# EAGLE design Template_V0.1 (EAGLE 7.0.0)
CNAME: EARS PocketQube Template; CREVISION: 0.1; DESIGNER: M. Isbell & L. Stant
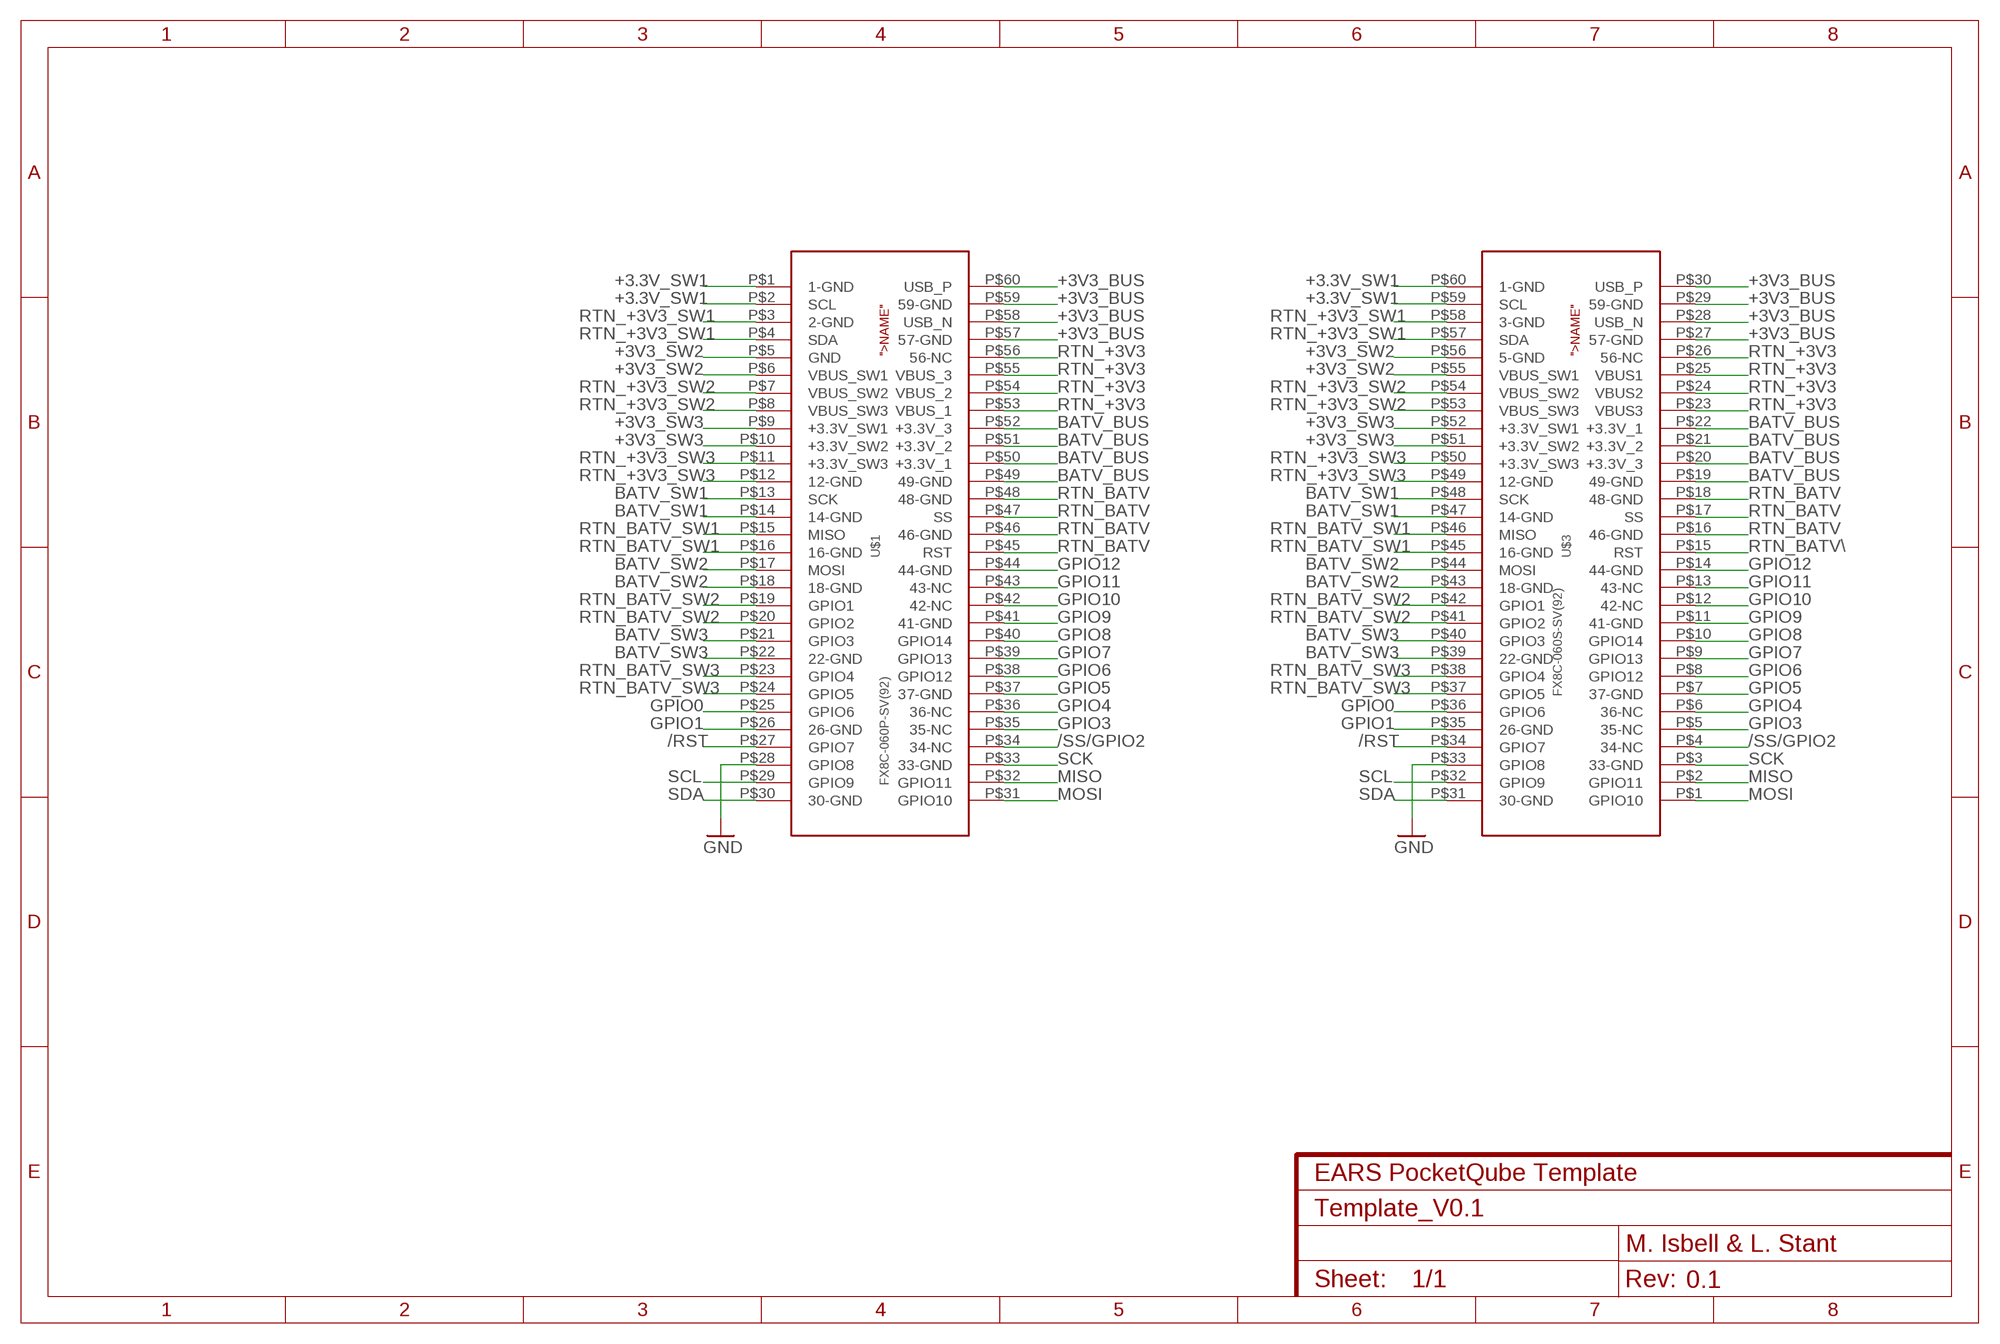
[diagram p0: schematic, sheet 1]

## Parts
U$1  FX8C-060P-SV(92)  [FX8C-060P-SV(92)]
U$3  FX8C-060S-SV(92)  [FX8C-060S-SV(92)]

## Nets
+3.3V_SW1: U$1.P$1(1-GND) U$1.P$2(SCL) U$3.P$59(SCL) U$3.P$60(1-GND)
+3V3_BUS: U$1.P$57(57-GND) U$1.P$58(USB_N) U$1.P$59(59-GND) U$1.P$60(USB_P)
+3V3_SW2: U$1.P$5(GND) U$1.P$6(VBUS_SW1) U$3.P$55(VBUS_SW1) U$3.P$56(5-GND)
+3V3_SW3: U$1.P$9(+3.3V_SW1) U$1.P$10(+3.3V_SW2) U$3.P$51(+3.3V_SW2) U$3.P$52(+3.3V_SW1)
/RST: U$1.P$27(GPIO7) U$3.P$34(GPIO7)
/SS/GPIO2: U$1.P$34(34-NC)
BATV_BUS: U$1.P$49(49-GND) U$1.P$50(+3.3V_1) U$1.P$51(+3.3V_2) U$1.P$52(+3.3V_3)
BATV_SW1: U$1.P$13(SCK) U$1.P$14(14-GND) U$3.P$47(14-GND) U$3.P$48(SCK)
BATV_SW2: U$1.P$17(MOSI) U$1.P$18(18-GND) U$3.P$43(18-GND) U$3.P$44(MOSI)
BATV_SW3: U$1.P$21(GPIO3) U$1.P$22(22-GND) U$3.P$39(22-GND) U$3.P$40(GPIO3)
GND: U$1.P$28(GPIO8) U$3.P$33(GPIO8)
GPIO0: U$1.P$25(GPIO6) U$3.P$36(GPIO6)
GPIO1: U$1.P$26(26-GND) U$3.P$35(26-GND)
GPIO3: U$1.P$35(35-NC)
GPIO4: U$1.P$36(36-NC)
GPIO5: U$1.P$37(37-GND)
GPIO6: U$1.P$38(GPIO12)
GPIO7: U$1.P$39(GPIO13)
GPIO8: U$1.P$40(GPIO14)
GPIO9: U$1.P$41(41-GND)
GPIO10: U$1.P$42(42-NC)
GPIO11: U$1.P$43(43-NC)
GPIO12: U$1.P$44(44-GND)
MISO: U$1.P$32(GPIO11)
MOSI: U$1.P$31(GPIO10)
RTN_+3V3: U$1.P$53(VBUS_1) U$1.P$54(VBUS_2) U$1.P$55(VBUS_3) U$1.P$56(56-NC)
RTN_+3V3_SW1: U$1.P$3(2-GND) U$1.P$4(SDA) U$3.P$57(SDA) U$3.P$58(3-GND)
RTN_+3V3_SW2: U$1.P$7(VBUS_SW2) U$1.P$8(VBUS_SW3) U$3.P$53(VBUS_SW3) U$3.P$54(VBUS_SW2)
RTN_+3V3_SW3: U$1.P$11(+3.3V_SW3) U$1.P$12(12-GND) U$3.P$49(12-GND) U$3.P$50(+3.3V_SW3)
RTN_BATV: U$1.P$45(RST) U$1.P$46(46-GND) U$1.P$47(SS) U$1.P$48(48-GND)
RTN_BATV_SW1: U$1.P$15(MISO) U$1.P$16(16-GND) U$3.P$45(16-GND) U$3.P$46(MISO)
RTN_BATV_SW2: U$1.P$19(GPIO1) U$1.P$20(GPIO2) U$3.P$41(GPIO2) U$3.P$42(GPIO1)
RTN_BATV_SW3: U$1.P$23(GPIO4) U$1.P$24(GPIO5) U$3.P$37(GPIO5) U$3.P$38(GPIO4)
SCK: U$1.P$33(33-GND)
SCL: U$1.P$29(GPIO9) U$3.P$32(GPIO9)
SDA: U$1.P$30(30-GND) U$3.P$31(30-GND)
Unconnected: U$3.P$1(GPIO10) U$3.P$2(GPIO11) U$3.P$4(34-NC) U$3.P$5(35-NC) U$3.P$6(36-NC) U$3.P$8(GPIO12) U$3.P$9(GPIO13) U$3.P$10(GPIO14) U$3.P$12(42-NC) U$3.P$13(43-NC) U$3.P$15(RST) U$3.P$17(SS) U$3.P$23(VBUS3) U$3.P$25(VBUS1) U$3.P$26(56-NC) U$3.P$28(USB_N) U$3.P$30(USB_P)

## Power pins joined to a net without a drawn wire
33-GND: U$3.P$3(33-GND)
37-GND: U$3.P$7(37-GND)
41-GND: U$3.P$11(41-GND)
44-GND: U$3.P$14(44-GND)
46-GND: U$3.P$16(46-GND)
48-GND: U$3.P$18(48-GND)
49-GND: U$3.P$19(49-GND)
57-GND: U$3.P$27(57-GND)
59-GND: U$3.P$29(59-GND)
+3.3V_1: U$3.P$22(+3.3V_1)
+3.3V_2: U$3.P$21(+3.3V_2)
+3.3V_3: U$3.P$20(+3.3V_3)
VBUS2: U$3.P$24(VBUS2)

## Library data of the parts
U$1 = PQ_components:FX8C-060P-SV(92): FX8C-060P-SV(92) Hirose plug, for use in the PocketQube Standard boards. Device model created 10/2/14 By Stuart McAndrew AKA OzQube-1 Twitter - @ssshocker
U$3 = PQ_components:FX8C-060S-SV(92): This is the bottom connector for a standard PocketQube board. Created by Stuart McAndrew AKA OzQube-1 17/2/14

## Board
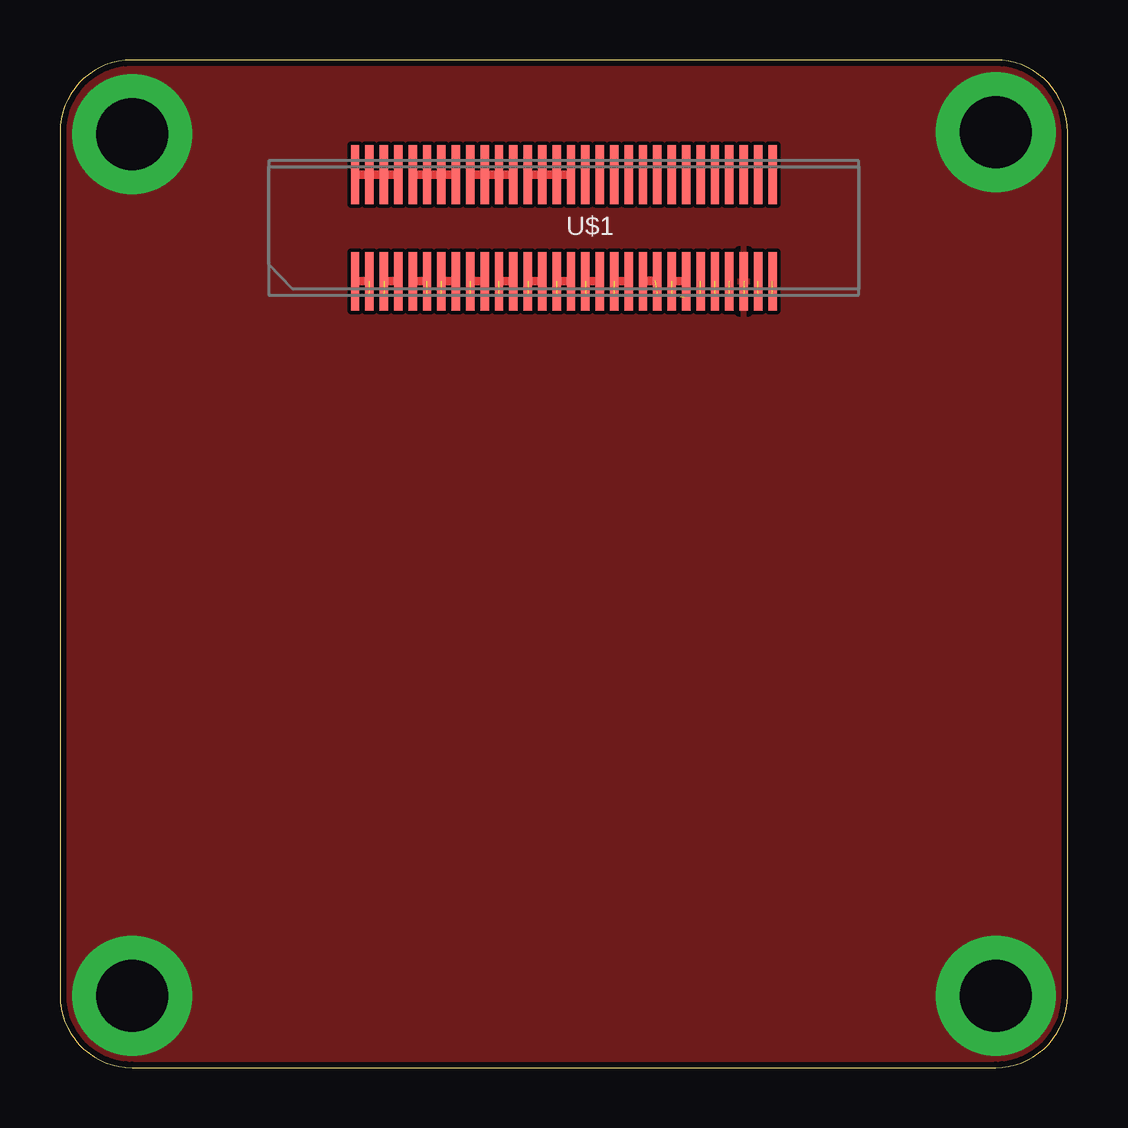
[diagram p1: board, top side]
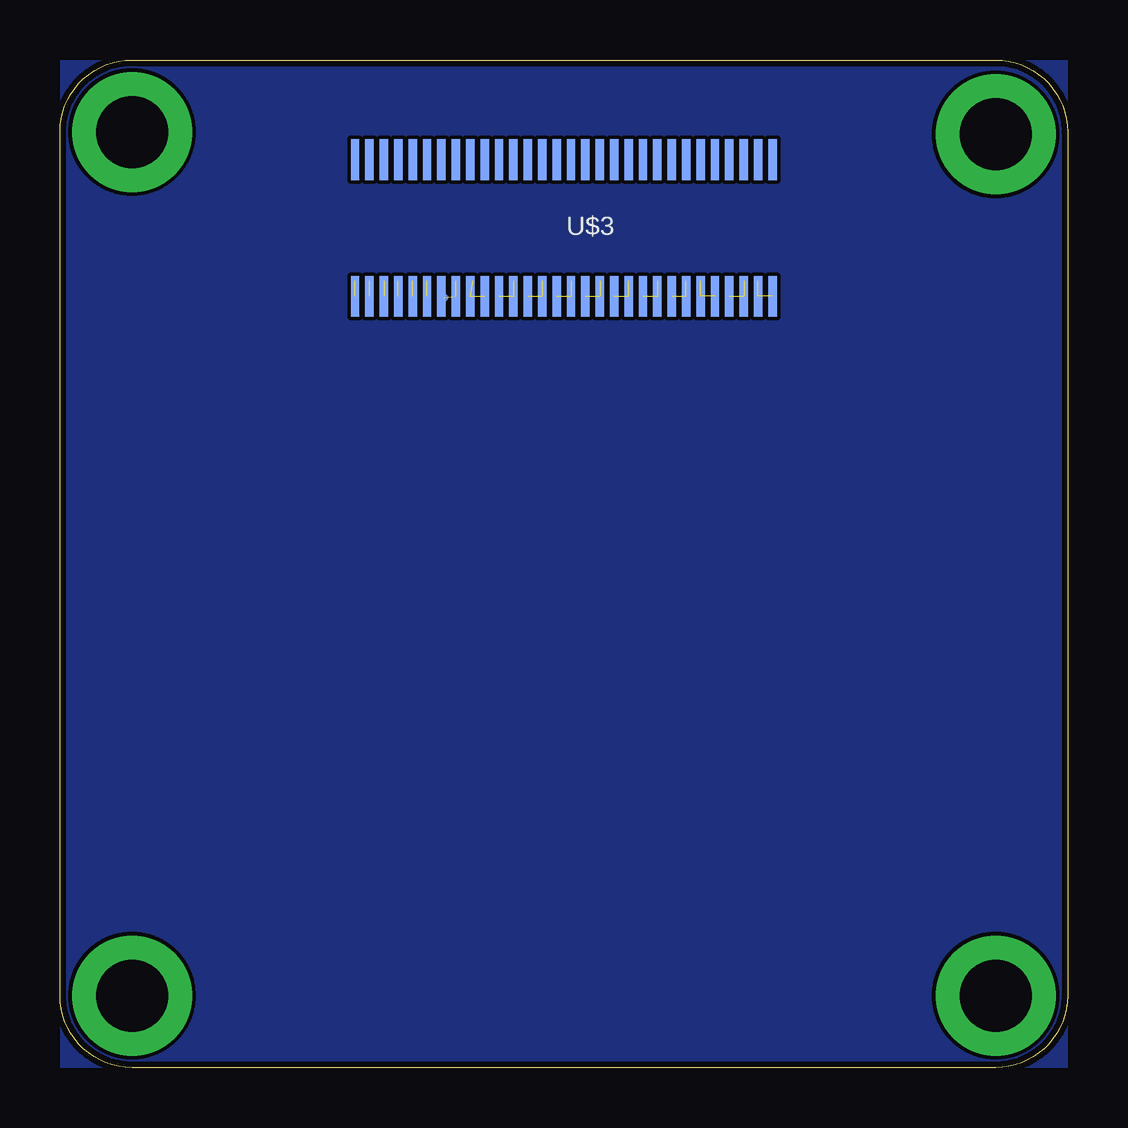
[diagram p2: board, bottom side, seen from below]

Size 42 x 42 mm. Coordinates in mm from the lower left corner, seen from the top.
Outline: 3,0 39,0 arc90 42,3 42,39 arc90 39,42 3,42 arc90 0,39 0,3 arc90 3,0
Copper layers (1*16): Top 0.035mm / dielectric 1.5mm / Bottom 0.035mm
Design rules "SeeedStudio_2layer_DRU_no_angle_20140221": minimum track width 6mil, minimum drill 12mil, track to track 6mil, track to pad 6mil, pad to pad 6mil, via to via 6mil, smd to smd 0mil, copper to edge 10mil, drill to drill 10mil, minimum pad ring 10mil, minimum via ring 6mil, stop-mask expansion 2mil, vias tented up to drill 100mil, thermal gap 10mil

### Footprints (pad centres in the part's own frame; a part is rotated, then mirrored left to right if it is on the bottom)
FX8C-060P-SV(92) = smd 0.35 x 2.45: P$1 -8.7,-2.225; P$2 -8.1,-2.225; P$3 -7.5,-2.225; P$4 -6.9,-2.225; P$5 -6.3,-2.225; P$6 -5.7,-2.225; P$7 -5.1,-2.225; P$8 -4.5,-2.225; P$9 -3.9,-2.225; P$10 -3.3,-2.225; P$11 -2.7,-2.225; P$12 -2.1,-2.225; P$13 -1.5,-2.225; P$14 -0.9,-2.225; P$15 -0.3,-2.225; P$16 0.3,-2.225; P$17 0.9,-2.225; P$18 1.5,-2.225; P$19 2.1,-2.225; P$20 2.7,-2.225; P$21 3.3,-2.225; P$22 3.9,-2.225; P$23 4.5,-2.225; P$24 5.1,-2.225; P$25 5.7,-2.225; P$26 6.3,-2.225; P$27 6.9,-2.225; P$28 7.5,-2.225; P$29 8.1,-2.225; P$30 8.7,-2.225; P$31 8.7,2.225; P$32 8.1,2.225; P$33 7.5,2.225; P$34 6.9,2.225; P$35 6.3,2.225; P$36 5.7,2.225; P$37 5.1,2.225; P$38 4.5,2.225; P$39 3.9,2.225; P$40 3.3,2.225; P$41 2.7,2.225; P$42 2.1,2.225; P$43 1.5,2.225; P$44 0.9,2.225; P$45 0.3,2.225; P$46 -0.3,2.225; P$47 -0.9,2.225; P$48 -1.5,2.225; P$49 -2.1,2.225; P$50 -2.7,2.225; P$51 -3.3,2.225; P$52 -3.9,2.225; P$53 -4.5,2.225; P$54 -5.1,2.225; P$55 -5.7,2.225; P$56 -6.3,2.225; P$57 -6.9,2.225; P$58 -7.5,2.225; P$59 -8.1,2.225; P$60 -8.7,2.225
FX8C-060S-SV(92) = smd 0.35 x 1.7: P$1 -8.7,2.85; P$2 -8.1,2.85; P$3 -7.5,2.85; P$4 -6.9,2.85; P$5 -6.3,2.85; P$6 -5.7,2.85; P$7 -5.1,2.85; P$8 -4.5,2.85; P$9 -3.9,2.85; P$10 -3.3,2.85; P$11 -2.7,2.85; P$12 -2.1,2.85; P$13 -1.5,2.85; P$14 -0.9,2.85; P$15 -0.3,2.85; P$16 0.3,2.85; P$17 0.9,2.85; P$18 1.5,2.85; P$19 2.1,2.85; P$20 2.7,2.85; P$21 3.3,2.85; P$22 3.9,2.85; P$23 4.5,2.85; P$24 5.1,2.85; P$25 5.7,2.85; P$26 6.3,2.85; P$27 6.9,2.85; P$28 7.5,2.85; P$29 8.1,2.85; P$30 8.7,2.85; P$31 -8.7,-2.85; P$32 -8.1,-2.85; P$33 -7.5,-2.85; P$34 -6.9,-2.85; P$35 -6.3,-2.85; P$36 -5.7,-2.85; P$37 -5.1,-2.85; P$38 -4.5,-2.85; P$39 -3.9,-2.85; P$40 -3.3,-2.85; P$41 -2.7,-2.85; P$42 -2.1,-2.85; P$43 -1.5,-2.85; P$44 -0.9,-2.85; P$45 -0.3,-2.85; P$46 0.3,-2.85; P$47 0.9,-2.85; P$48 1.5,-2.85; P$49 2.1,-2.85; P$50 2.7,-2.85; P$51 3.3,-2.85; P$52 3.9,-2.85; P$53 4.5,-2.85; P$54 5.1,-2.85; P$55 5.7,-2.85; P$56 6.3,-2.85; P$57 6.9,-2.85; P$58 7.5,-2.85; P$59 8.1,-2.85; P$60 8.7,-2.85

### Placement (x,y rotation side)
U$1  21,35 0 top
U$3  21,35 0 bottom

### Tracks (layer width: path | path; a pad name or v marks a point on that pad's centre or on a via)
+3.3V_SW1  (2 unrouted)
  Top 0.35: U$1.P$1 U$1.P$2
+3V3_BUS
  Top 0.35: U$1.P$60 U$1.P$59 U$1.P$58 U$1.P$57
+3V3_SW2  (2 unrouted)
  Top 0.35: U$1.P$5 U$1.P$6
+3V3_SW3  (2 unrouted)
  Top 0.35: U$1.P$9 U$1.P$10
/RST  (1 unrouted)
BATV_BUS
  Top 0.35: U$1.P$52 U$1.P$51 U$1.P$50 U$1.P$49
BATV_SW1  (2 unrouted)
  Top 0.35: U$1.P$13 U$1.P$14
BATV_SW2  (2 unrouted)
  Top 0.35: U$1.P$17 U$1.P$18
BATV_SW3  (2 unrouted)
  Top 0.35: U$1.P$22 U$1.P$21 24.32,32.8 24.8,32.8
GND  (via drill 3 pad 5)  (1 unrouted)
  other vias: 3,38.9 39,39 39,3 3,3
  pour Top: 0,42 42,42 42,0 0,0
GPIO0  (1 unrouted)
GPIO1  (1 unrouted)
N$1
  pour Bottom: 0,42 42,42 42,0 0,0
RTN_+3V3
  Top 0.35: U$1.P$56 U$1.P$55 U$1.P$54 U$1.P$53
RTN_+3V3_SW1  (2 unrouted)
  Top 0.35: U$1.P$3 U$1.P$4
RTN_+3V3_SW2  (2 unrouted)
  Top 0.35: U$1.P$7 U$1.P$8
RTN_+3V3_SW3  (2 unrouted)
  Top 0.35: U$1.P$11 U$1.P$12
RTN_BATV
  Top 0.35: U$1.P$48 U$1.P$47 U$1.P$46 U$1.P$45
RTN_BATV_SW1  (2 unrouted)
  Top 0.35: U$1.P$15 U$1.P$16
RTN_BATV_SW2  (2 unrouted)
  Top 0.35: U$1.P$19 U$1.P$20
RTN_BATV_SW3  (2 unrouted)
  Top 0.35: U$1.P$23 U$1.P$24
  Bottom 0.35: U$3.P$37 26.05,32.1 26,32.1
SCL  (1 unrouted)
SDA  (1 unrouted)